# Altium project GUN_V2.PrjPcb
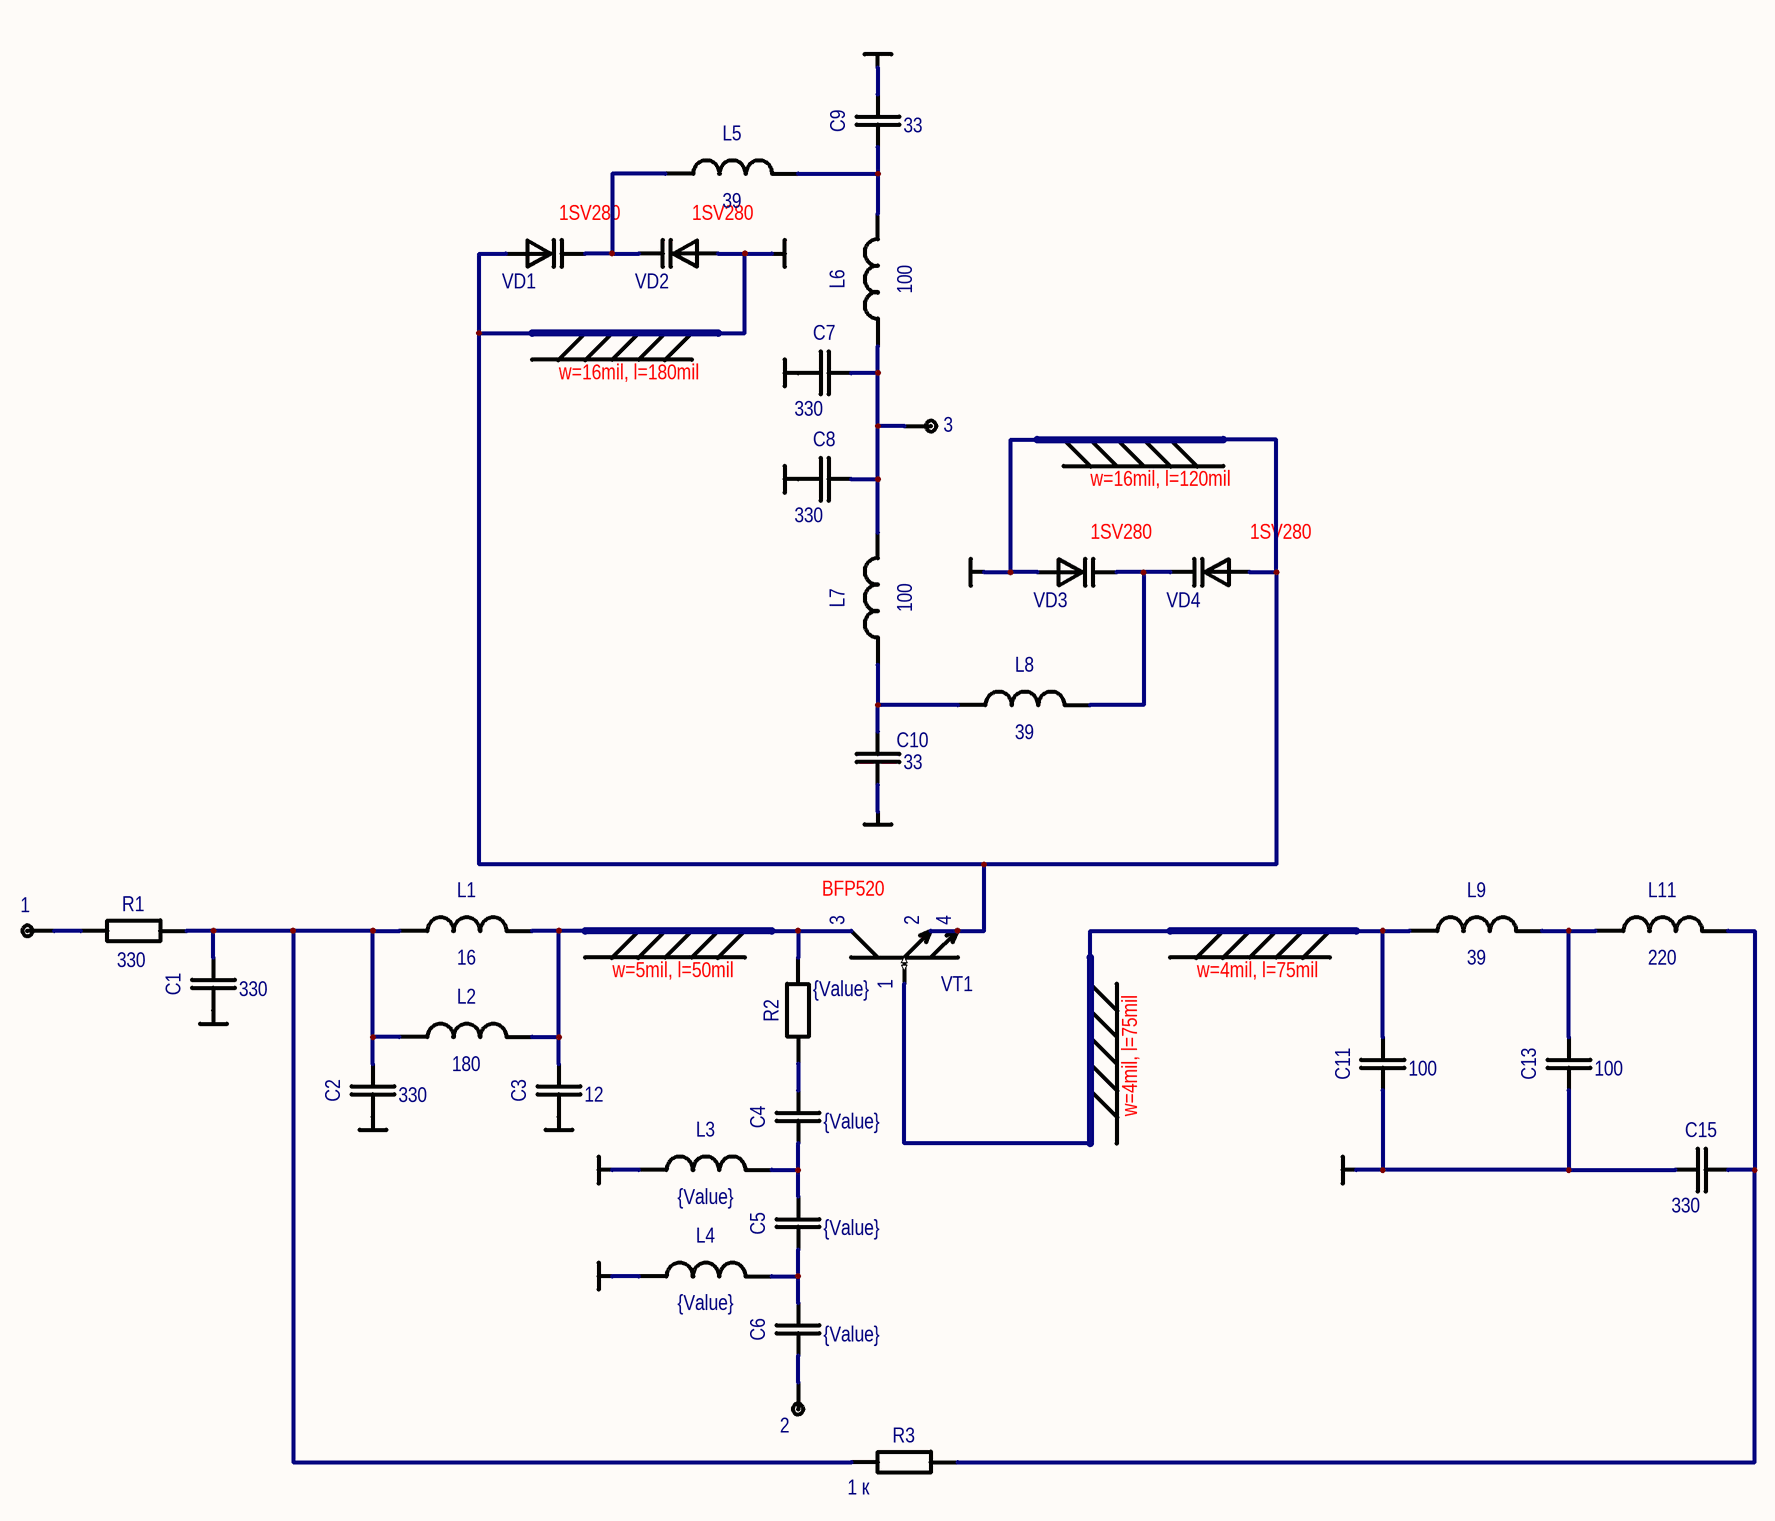
[diagram p0: Sheet1.SchDoc]
1 sheet, 46 parts. Net scope: global (net labels, ports and power ports of the same name join across sheets).
Board file: PCB_GUNV_2.PcbDoc

## Sheet Sheet1.SchDoc
size 594 x 420 mm

### Parts
(Parts that share a designator on the sheet are numbered #1, #2 ... from top to bottom, then left to right.)
1  TP  [TP1]  (value not drawn)  (no BOM)
2  TP  [TP1]  (value not drawn)  (no BOM)
3  TP  [TP1]  (value not drawn)  (no BOM)
*?#1  GND  (value not drawn)  (graphical)
*?#2  GND  (value not drawn)  (graphical)
*?#3  GND  (value not drawn)  (graphical)
*?#4  GND  (value not drawn)  (graphical)
*?#5  GND  (value not drawn)  (graphical)
*?#6  GND  (value not drawn)  (graphical)
*?#7  GND  (value not drawn)  (graphical)
*?#8  GND  (value not drawn)  (graphical)
*?#9  GND  (value not drawn)  (graphical)
*?#10  GND  (value not drawn)  (graphical)
*?#11  GND  (value not drawn)  (graphical)
*?#12  GND  (value not drawn)  (graphical)
C1  330  [CAPC1005L]
C2  330  [CAPC1005L]
C3  12  [CAPC1005L]
C4  {Value}  [CAPC1005L]
C5  {Value}  [CAPC1005L]
C6  {Value}  [CAPC1005L]
C7  330  [CAPC1005L]
C8  330  [CAPC1005L]
C9  33  [CAPC1005L]
C10  33  [CAPC1005L]
C11  100  [CAPC1005L]
C13  100  [CAPC1005L]
C15  330  [CAPC1005L]
L1  16  [INDC1107X07N]
L2  180  [INDC1608L]
L3  {Value}  [INDC1107X07N]
L4  {Value}  [INDC1107X07N]
L5  39  [INDC1107X07N]
L6  100  [INDC1005L]
L7  100  [INDC1005L]
L8  39  [INDC1107X07N]
L9  39  [INDC1107X07N]
L11  220  [INDC1005L]
R1  330  [RESC1005L]
R2  {Value}  [RESC1005L]
R3  1 к  [RESC1005L]
VD1  BB149  [SOD2512X100N]  (value not drawn)
VD2  BB149  [SOD2512X100N]  (value not drawn)
VD3  BB149  [SOD2512X100N]  (value not drawn)
VD4  BB149  [SOD2512X100N]  (value not drawn)
VT1  (no value)  [SOT130P210X100-4N]

### Nets
GND: C1.1 C2.1 C3.1 C7.1 C8.1 C9.2 C10.2 C11.1 C13.1 C15.1 L3.1 L4.1 VD1.2(Anode) VD2.2(Anode) VD3.2(Anode) VD4.2(Anode) VT1.2(Emitter) VT1.4(Emitter)
Net1_1: 1.1 R1.1
Net2_1: 2.1 C6.1
Net3_1: 3.1 C7.2 C8.2 L6.1 L7.2
NetC1_2: C1.2 C2.2 L1.1 L2.1 R1.2 R3.1
NetC3_2: C3.2 L1.2 L2.2 R2.2 VT1.3(Collector)
NetC4_1: C4.1 C5.2 L3.2
NetC4_2: C4.2 R2.1
NetC5_1: C5.1 C6.2 L4.2
NetC9_1: C9.1 L5.2 L6.2
NetC10_1: C10.1 L7.1 L8.1
NetC11_2: C11.2 L9.1 VT1.1(Base)
NetC13_2: C13.2 L9.2 L11.1
NetC15_2: C15.2 L11.2 R3.2
NetL5_1: L5.1 VD1.1(Cathode) VD2.1(Cathode)
NetL8_2: L8.2 VD3.1(Cathode) VD4.1(Cathode)

### Notes on the sheet
- (near VD1) 1SV280
- 1SV280
- w=16mil, l=180mil
- w=16mil, l=120mil
- (near VD3) 1SV280
- (near VD4) 1SV280
- (near VT1) BFP520
- (near R2) w=5mil, l=50mil
- w=4mil, l=75mil
- Перв. примен.
- Зам.гл.к.по констр.
- Справ. №
- Нач. подр. выд.ТЗ
- Подп. и дата
- Инв. № дубл.
- СН
- Взам. инв. №
- Изм.
- Лист
- № докум.
- Подп.
- Дата
- Лит.
- Масса
- Масштаб
- Т.контр.
- Пров.
- Разраб.
- Листов
- Нач. КС
- Инв. № подл.
- Н.контр.
- Утв.
- Копировал
- Формат А2

### Library data of the parts
1-3 = TP: Test point
*?#1-*?#12 = GND: Корпус ЕСКД. Для "наложения" на штатный Power Bar
C1 C2 C7 C8 C15 = i6124B5A08767D00004E: Чип-конденсатор; ManufacturerPartNumber: GRM1555C1H331JA01* Murata; Name: 0402; Power/Voltage: 50 В; TKE/TKC: C0G; Tolerance: ±5 %; PCADSymbol: C; PCADLibrary: PASSIV.LIB; BCPId: *; Manufacturer: *; Type: Конденсатор; Value: 330; ImKey: i6124B5A08767D00004E; PCADType: C0402; PCADPattern: C0402
C3 = i6124B5A08767D00007A: Чип-конденсатор; ManufacturerPartNumber: GCM1555C1H120JA16* Murata; Name: 0402; Power/Voltage: 50 В; TKE/TKC: C0G; Tolerance: ±5 %; PCADSymbol: C; PCADLibrary: PASSIV.LIB; BCPId: *; Manufacturer: *; Type: Конденсатор; Value: 12; ImKey: i6124B5A08767D00007A; PCADType: C0402; PCADPattern: C0402
C4-C6 = C0402: Чип-конденсатор; Name: 0402; Power/Voltage: {Voltage}; TKE/TKC: {TKE/TKC}; Tolerance: {Tolerance}; BCPId: *; Manufacturer: *; ManufacturerPartNumber: *; Type: Конденсатор; Value: {Value}
C9 C10 = i6124B5A08767D000030: Чип-конденсатор; ManufacturerPartNumber: GRM1555C1H330JA01* Murata; Name: 0402; Power/Voltage: 50 В; TKE/TKC: C0G; Tolerance: ±5 %; PCADSymbol: C; PCADLibrary: PASSIV.LIB; BCPId: *; Manufacturer: *; Type: Конденсатор; Value: 33; ImKey: i6124B5A08767D000030; PCADType: C0402; PCADPattern: C0402
C11 C13 = i6124B5A08767D000072: Чип-конденсатор; ManufacturerPartNumber: GCM1555C1H101JA16* Murata; Name: 0402; Power/Voltage: 50 В; TKE/TKC: C0G; Tolerance: ±5 %; PCADSymbol: C; PCADLibrary: PASSIV.LIB; BCPId: *; Manufacturer: *; Type: Конденсатор; Value: 100; ImKey: i6124B5A08767D000072; PCADType: C0402; PCADPattern: C0402
L1 = i6124B5A0876BE00000C: Индуктивность без магнитопровода; ManufacturerPartNumber: 0402DC-16NXJR* Coilcraft; Name: 0402DC; Tolerance: ±5 %; PCADType: L-0402; PCADSymbol: INDUCT; PCADPattern: L0402M; PCADLibrary: PASSIV.LIB; BCPId: *; Manufacturer: *; Package: *; Type: Индуктивность; Value: 16; ImKey: i6124B5A0876BE00000C
L2 = i6124B5A0876B6000015: Индуктивность без магнитопровода; ManufacturerPartNumber: 0603CS-R18XJE* Coilcraft; Name: 0603; Tolerance: ±5 %; PCADType: L-0603; PCADSymbol: INDUCT; PCADPattern: L0603M; PCADLibrary: PASSIV.LIB; BCPId: *; Manufacturer: *; Package: *; Type: Индуктивность; Value: 180; ImKey: i6124B5A0876B6000015
L3 L4 = L0402DC: Индуктивность без магнитопровода; Name: 0402DC; Tolerance: {Tolerance}; BCPId: *; Manufacturer: *; Package: *; ManufacturerPartNumber: *; Type: Индуктивность; Value: {Value}
L5 L8 L9 = i6124B5A0876BE000006: Индуктивность без магнитопровода; ManufacturerPartNumber: 0402DC-39NXJR* Coilcraft; Name: 0402DC; Tolerance: ±5 %; PCADType: L-0402; PCADSymbol: INDUCT; PCADPattern: L0402M; PCADLibrary: PASSIV.LIB; BCPId: *; Manufacturer: *; Package: *; Type: Индуктивность; Value: 39; ImKey: i6124B5A0876BE000006
L6 L7 = L0402: Индуктивность без магнитопровода; Name: 0402; Tolerance: {Tolerance}; BCPId: 100; Manufacturer: *; Package: *; ManufacturerPartNumber: *; Type: Индуктивность; Value: 100
L11 = L0402: Индуктивность без магнитопровода; BCPId: 100; Name: 0402; Tolerance: {Tolerance}; Manufacturer: *; Package: *; ManufacturerPartNumber: *; Type: Индуктивность; Value: 220
R1 = i6124B5A0876CB00001D: Чип-резистор; ManufacturerPartNumber: CR0402-JW-331GLF Bourns; Name: 0402; Tolerance: ±5 %; PCADSymbol: R; PCADLibrary: PASSIV.LIB; BCPId: *; Manufacturer: *; Type: Резистор; Value: 330; ImKey: i6124B5A0876CB00001D; PCADType: R0402; PCADPattern: R0402
R2 = R0402: Чип-резистор; Name: 0402; Tolerance: {Tolerance}; BCPId: *; Manufacturer: *; ManufacturerPartNumber: *; Type: Резистор; Value: {Value}
R3 = i6124B5A0876CB000025: Чип-резистор; ManufacturerPartNumber: CR0402-JW-102GLF Bourns; Name: 0402; Tolerance: ±5 %; PCADSymbol: R; PCADLibrary: PASSIV.LIB; BCPId: *; Manufacturer: *; Type: Резистор; Value: 1 к; ImKey: i6124B5A0876CB000025; PCADType: R0402; PCADPattern: R0402
VD1-VD4 = BB149: UHF variable capacitance diode; Manufacturer: NXP; ManufacturerPartNumber: BB149A; Type: Диод; SymAuthor: Юдин Д.Г.; BCPId: *; Name: *; Package: SC-76 (SOD323)
VT1 = BFP540: Low Noise Silicon Bipolar RF Transistor; Manufacturer: Infineon; Type: Транзистор; BCPId: *; ManufacturerPartNumber: BFP540; Package: SOT343